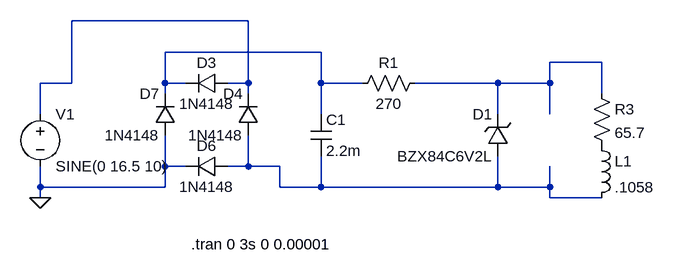
[diagram p0: schematic Circuit.asc]
Circuit.asc, the LTspice schematic file:
Version 4
SHEET 1 880 680
WIRE -96 -48 -368 -48
WIRE 16 0 -224 0
WIRE 448 16 368 16
WIRE -368 48 -368 -48
WIRE -368 48 -416 48
WIRE -224 48 -224 0
WIRE -192 48 -224 48
WIRE -96 48 -96 -48
WIRE -96 48 -128 48
WIRE 16 48 16 0
WIRE 80 48 16 48
WIRE 288 48 160 48
WIRE 368 48 368 16
WIRE 368 48 288 48
WIRE -224 64 -224 48
WIRE -96 64 -96 48
WIRE 448 64 448 16
WIRE -416 96 -416 48
WIRE 16 96 16 48
WIRE 288 96 288 48
WIRE 368 96 368 48
WIRE -224 176 -224 128
WIRE -192 176 -224 176
WIRE -96 176 -96 128
WIRE -96 176 -128 176
WIRE -48 176 -96 176
WIRE -416 208 -416 176
WIRE -224 208 -224 176
WIRE -224 208 -416 208
WIRE -48 208 -48 176
WIRE 16 208 16 160
WIRE 16 208 -48 208
WIRE 288 208 288 160
WIRE 288 208 16 208
WIRE 368 208 368 176
WIRE 368 208 288 208
WIRE -416 224 -416 208
WIRE 368 224 368 208
WIRE 448 224 368 224
FLAG -416 224 0
SYMBOL cap 0 96 R0
SYMATTR InstName C1
SYMATTR Value 2.2m
SYMATTR SpiceLine IC=0
SYMBOL res 176 32 R90
WINDOW 0 0 56 VBottom 2
WINDOW 3 32 56 VTop 2
SYMATTR InstName R1
SYMATTR Value 270
SYMBOL voltage -416 80 R0
WINDOW 123 0 0 Left 2
WINDOW 39 0 0 Left 2
SYMATTR InstName V1
SYMATTR Value SINE(0 16.5 10)
SYMBOL diode -128 32 R90
WINDOW 0 0 32 VBottom 2
WINDOW 3 32 32 VTop 2
SYMATTR InstName D3
SYMATTR Value 1N4148
SYMBOL diode -80 128 R180
WINDOW 0 24 64 Left 2
WINDOW 3 24 0 Left 2
SYMATTR InstName D4
SYMATTR Value 1N4148
SYMBOL diode -128 160 R90
WINDOW 0 0 32 VBottom 2
WINDOW 3 32 32 VTop 2
SYMATTR InstName D6
SYMATTR Value 1N4148
SYMBOL diode -208 128 R180
WINDOW 0 24 64 Left 2
WINDOW 3 24 0 Left 2
SYMATTR InstName D7
SYMATTR Value 1N4148
SYMBOL zener 304 160 R180
WINDOW 0 24 64 Left 2
WINDOW 3 24 0 Left 2
SYMATTR InstName D1
SYMATTR Value BZX84C6V2L
SYMBOL ind 432 128 R0
SYMATTR InstName L1
SYMATTR Value .1058
SYMBOL res 432 48 R0
SYMATTR InstName R3
SYMATTR Value 65.7
TEXT -184 296 Left 2 !.tran 0 3s 0 0.00001

The netlist it stands for:
* Circuit.asc
C1 N002 N004 2.2m IC=0
R1 N003 N002 270
V1 N001 0 SINE(0 16.5 10)
D3 N001 N002 1N4148
D4 N004 N001 1N4148
D6 N004 0 1N4148
D7 0 N002 1N4148
D1 N004 N003 BZX84C6V2L
L1 P001 N004 .1058
R3 N003 P001 65.7
.model D D
.lib standard.dio
.tran 0 3s 0 0.00001
.backanno
.end